# Altium schematic sheet Deneigus_PI_Arduino.SchDoc
size Tabloid; Date: Date; Author: Author 1; Revision: 1; Size: 11x17; Sheet_Name: PI_Arduino
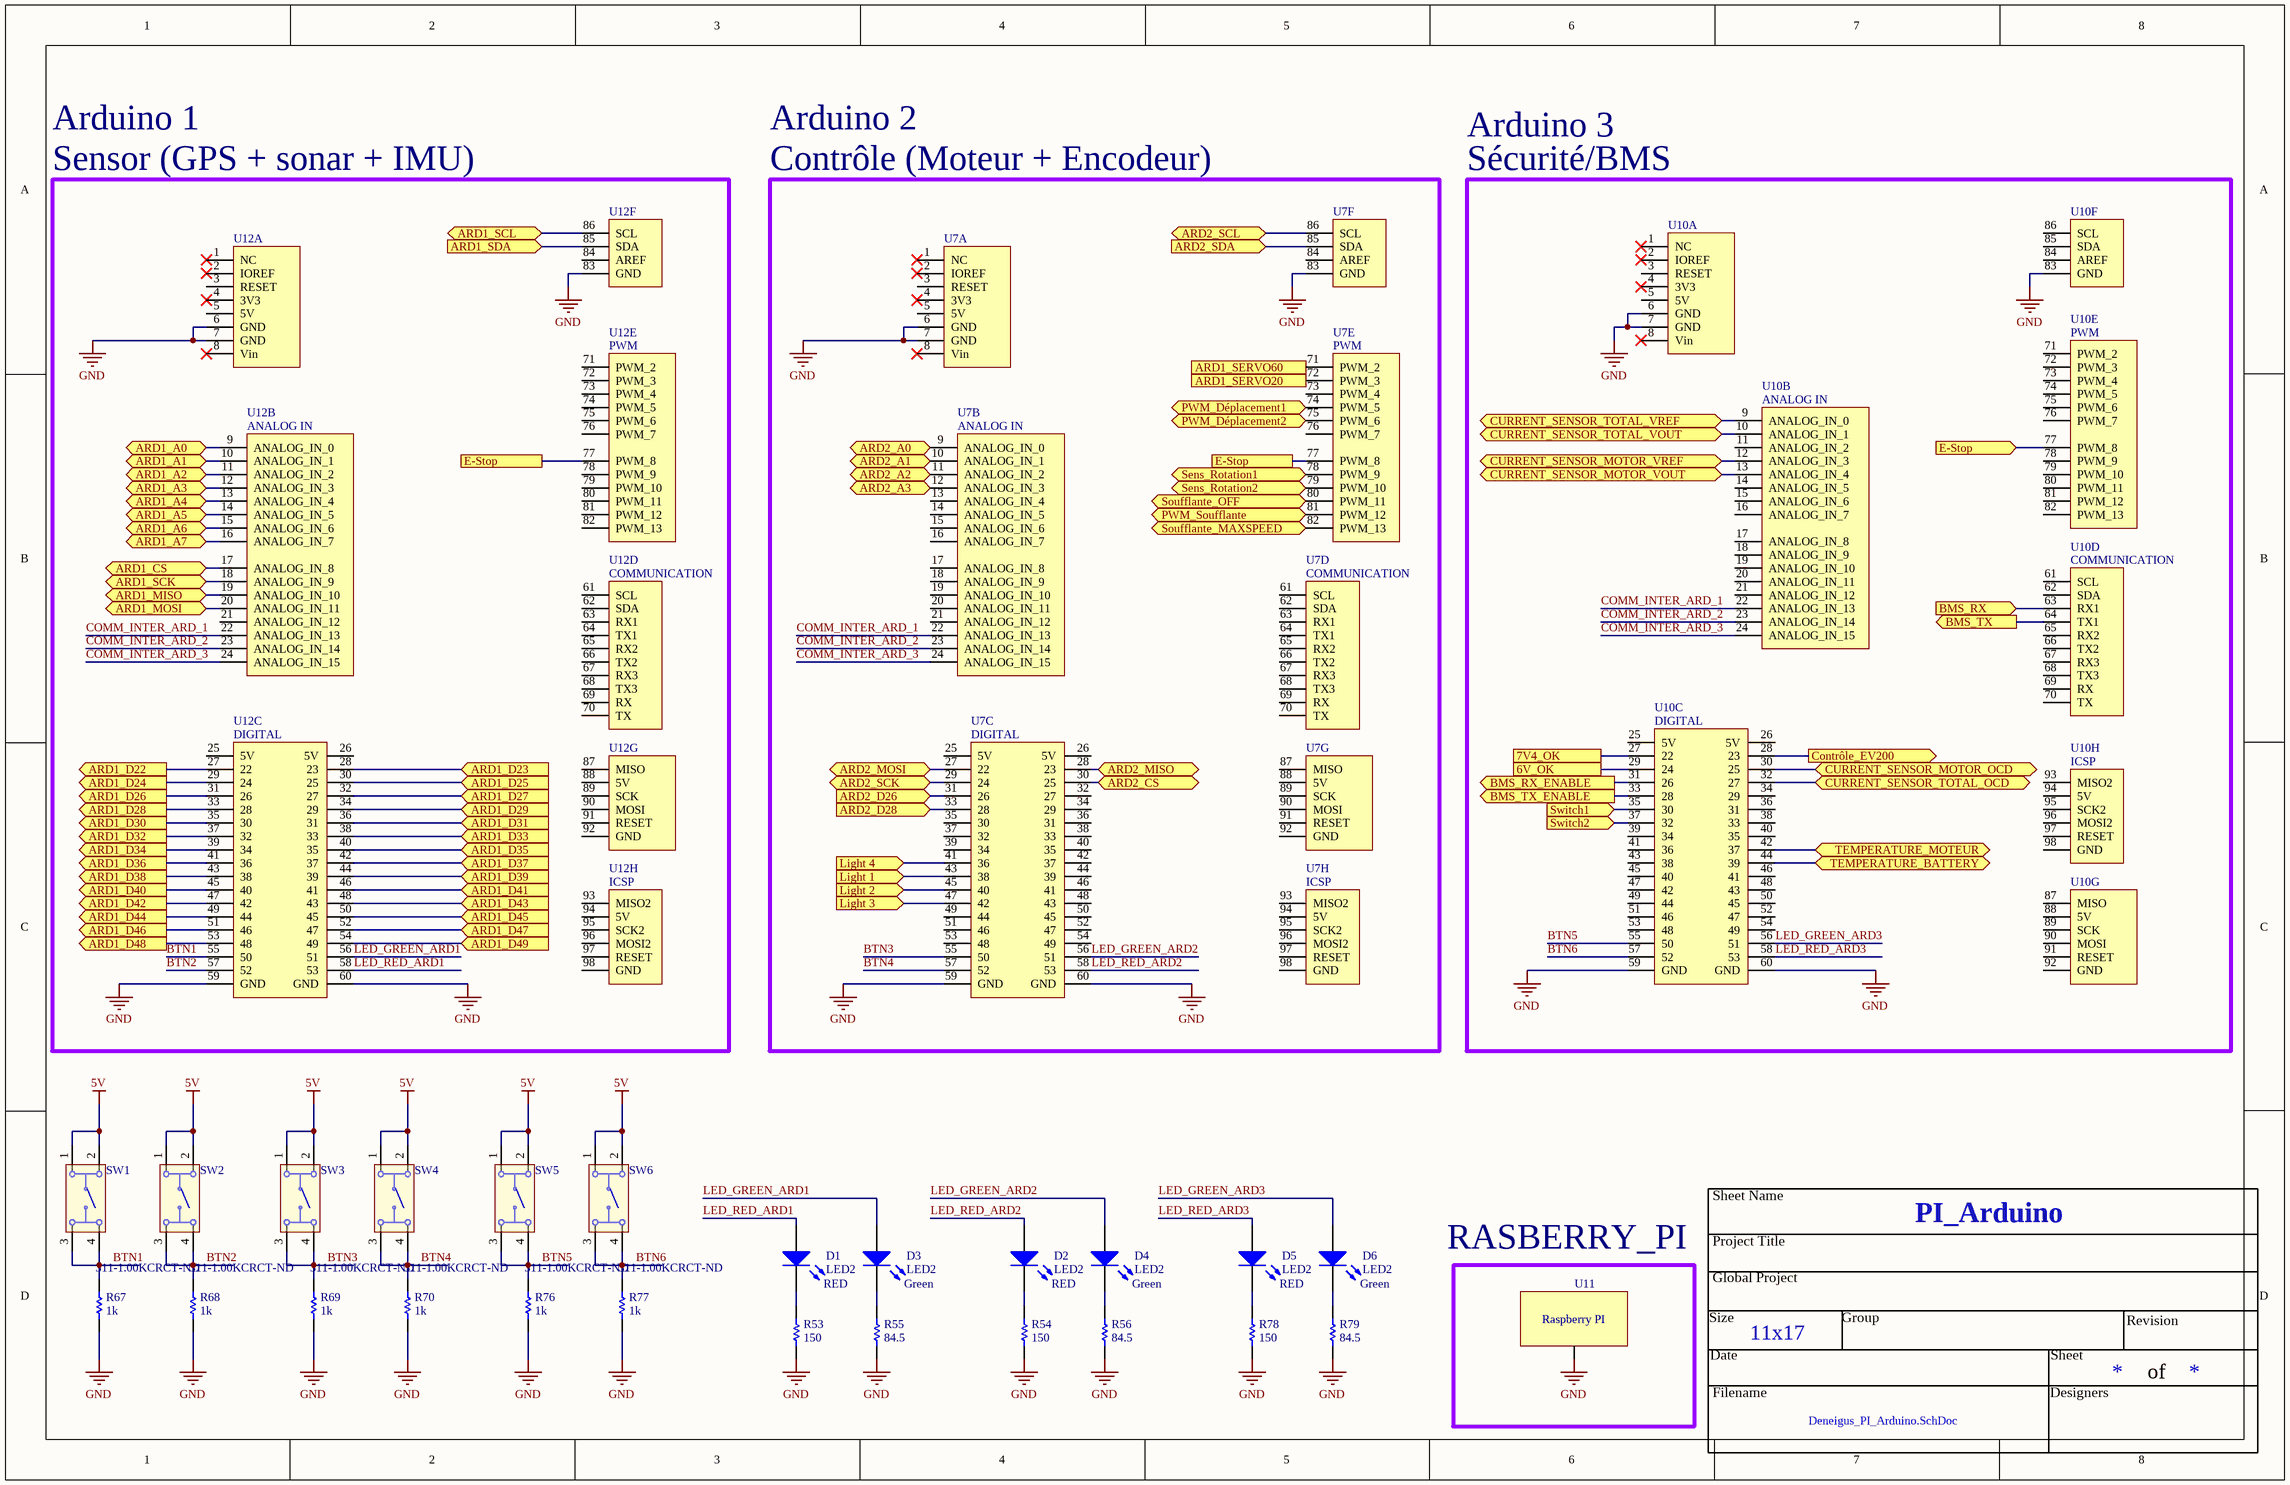
[diagram p0: Deneigus_PI_Arduino.SchDoc]

## Parts
D1  LED2  Color: RED  [DEL]
D2  LED2  Color: RED  [DEL]
D3  LED2  Color: Green  [DEL]
D4  LED2  Color: Green  [DEL]
D5  LED2  Color: RED  [DEL]
D6  LED2  Color: Green  [DEL]
R53  value 150  [RES_0805]  (hidden comment: Res1)
R54  value 150  [RES_0805]  (hidden comment: Res1)
R55  value 84.5  [RES_0805]  (hidden comment: Res1)
R56  value 84.5  [RES_0805]  (hidden comment: Res1)
R67  value 1k  Supplier Part Number 1: 311-1.00KCRCT-ND  [RES_0805]  (hidden comment: Res1)
R68  value 1k  Supplier Part Number 1: 311-1.00KCRCT-ND  [RES_0805]  (hidden comment: Res1)
R69  value 1k  Supplier Part Number 1: 311-1.00KCRCT-ND  [RES_0805]  (hidden comment: Res1)
R70  value 1k  Supplier Part Number 1: 311-1.00KCRCT-ND  [RES_0805]  (hidden comment: Res1)
R76  value 1k  Supplier Part Number 1: 311-1.00KCRCT-ND  [RES_0805]  (hidden comment: Res1)
R77  value 1k  Supplier Part Number 1: 311-1.00KCRCT-ND  [RES_0805]  (hidden comment: Res1)
R78  value 150  [RES_0805]  (hidden comment: Res1)
R79  value 84.5  [RES_0805]  (hidden comment: Res1)
SW1  430181038816  [430181038816]  (value not drawn)
SW2  430181038816  [430181038816]  (value not drawn)
SW3  430181038816  [430181038816]  (value not drawn)
SW4  430181038816  [430181038816]  (value not drawn)
SW5  430181038816  [430181038816]  (value not drawn)
SW6  430181038816  [430181038816]  (value not drawn)
U7  Arduino_Mega  [Arduino_Mega]  (value not drawn)  (parts A,B,C,D,E,F,G,H of 8)
U10  Arduino_Mega  [Arduino_Mega]  (value not drawn)  (parts A,B,C,D,E,F,G,H of 8)
U11  Raspberry PI 4  [Raspberry Pi 4]  (value not drawn)
U12  Arduino_Mega  [Arduino_Mega]  (value not drawn)  (parts A,B,C,D,E,F,G,H of 8)

## Blocks framed on the sheet
Sensor (GPS + sonar + IMU): U12
Contrôle (Moteur + Encodeur): U7
Sécurité/BMS: U10

## Ports
6V_OK, 7V4_OK, ARD1_A0 (bidir), ARD1_A1 (bidir), ARD1_A2 (bidir), ARD1_A3 (bidir), ARD1_A4 (bidir), ARD1_A5 (bidir), ARD1_A6 (bidir), ARD1_A7 (bidir), ARD1_CS (bidir), ARD1_D22 (out), ARD1_D23 (in), ARD1_D24 (out), ARD1_D25 (in), ARD1_D26 (out), ARD1_D27 (in), ARD1_D28 (out), ARD1_D29 (in), ARD1_D30 (out), ARD1_D31 (in), ARD1_D32 (out), ARD1_D33 (in), ARD1_D34 (out), ARD1_D35 (in), ARD1_D36 (out), ARD1_D37 (in), ARD1_D38 (out), ARD1_D39 (in), ARD1_D40 (out), ARD1_D41 (in), ARD1_D42 (out), ARD1_D43 (in), ARD1_D44 (out), ARD1_D45 (in), ARD1_D46 (out), ARD1_D47 (in), ARD1_D48 (out), ARD1_D49 (in), ARD1_MISO (bidir), ARD1_MOSI (bidir), ARD1_SCK (bidir), ARD1_SCL (bidir), ARD1_SDA (in), ARD1_SERVO20 (out), ARD1_SERVO60 (out), ARD2_A0 (bidir), ARD2_A1 (bidir), ARD2_A2 (bidir), ARD2_A3 (bidir), ARD2_CS (bidir), ARD2_D26 (in), ARD2_D28 (in), ARD2_MISO (bidir), ARD2_MOSI (bidir), ARD2_SCK (bidir), ARD2_SCL (bidir), ARD2_SDA (in), BMS_RX (in), BMS_RX_ENABLE (out), BMS_TX (out), BMS_TX_ENABLE (out), Contrôle_EV200 (out), CURRENT_SENSOR_MOTOR_OCD (bidir), CURRENT_SENSOR_MOTOR_VOUT (bidir), CURRENT_SENSOR_MOTOR_VREF (bidir), CURRENT_SENSOR_TOTAL_OCD (bidir), CURRENT_SENSOR_TOTAL_VOUT (bidir), CURRENT_SENSOR_TOTAL_VREF (bidir), E-Stop, E-Stop (in), Light 1 (in), Light 2 (in), Light 3 (in), Light 4 (in), PWM_Déplacement1 (bidir), PWM_Déplacement2 (bidir), PWM_Soufflante (bidir), Sens_Rotation1 (bidir), Sens_Rotation2 (bidir), Soufflante_MAXSPEED (bidir), Soufflante_OFF (bidir), Switch1 (in), Switch2 (in), TEMPERATURE_BATTERY (bidir), TEMPERATURE_MOTEUR (bidir)

## Nets
5V: SW1.1 SW1.2 SW2.1 SW2.2 SW3.1 SW3.2 SW4.1 SW4.2 SW5.1 SW5.2 SW6.1 SW6.2
GND: R53.2 R54.2 R55.2 R56.2 R67.2 R68.2 R69.2 R70.2 R76.2 R77.2 R78.2 R79.2 U7.6(GND) U7.7(GND) U7.59(GND) U7.60(GND) U7.83(GND) U10.6(GND) U10.7(GND) U10.59(GND) U10.60(GND) U10.83(GND) U11.0 U12.6(GND) U12.7(GND) U12.59(GND) U12.60(GND) U12.83(GND)
6V_OK: U10.29(24) ; port 6V_OK
7V4_OK: U10.27(22) ; port 7V4_OK
ARD1_A0: U12.9(ANALOG_IN_0) ; port ARD1_A0
ARD1_A1: U12.10(ANALOG_IN_1) ; port ARD1_A1
ARD1_A2: U12.11(ANALOG_IN_2) ; port ARD1_A2
ARD1_A3: U12.12(ANALOG_IN_3) ; port ARD1_A3
ARD1_A4: U12.13(ANALOG_IN_4) ; port ARD1_A4
ARD1_A5: U12.14(ANALOG_IN_5) ; port ARD1_A5
ARD1_A6: U12.15(ANALOG_IN_6) ; port ARD1_A6
ARD1_A7: U12.16(ANALOG_IN_7) ; port ARD1_A7
ARD1_CS: U12.17(ANALOG_IN_8) ; port ARD1_CS
ARD1_D22: U12.27(22) ; port ARD1_D22
ARD1_D23: U12.28(23) ; port ARD1_D23
ARD1_D24: U12.29(24) ; port ARD1_D24
ARD1_D25: U12.30(25) ; port ARD1_D25
ARD1_D26: U12.31(26) ; port ARD1_D26
ARD1_D27: U12.32(27) ; port ARD1_D27
ARD1_D28: U12.33(28) ; port ARD1_D28
ARD1_D29: U12.34(29) ; port ARD1_D29
ARD1_D30: U12.35(30) ; port ARD1_D30
ARD1_D31: U12.36(31) ; port ARD1_D31
ARD1_D32: U12.37(32) ; port ARD1_D32
ARD1_D33: U12.38(33) ; port ARD1_D33
ARD1_D34: U12.39(34) ; port ARD1_D34
ARD1_D35: U12.40(35) ; port ARD1_D35
ARD1_D36: U12.41(36) ; port ARD1_D36
ARD1_D37: U12.42(37) ; port ARD1_D37
ARD1_D38: U12.43(38) ; port ARD1_D38
ARD1_D39: U12.44(39) ; port ARD1_D39
ARD1_D40: U12.45(40) ; port ARD1_D40
ARD1_D41: U12.46(41) ; port ARD1_D41
ARD1_D42: U12.47(42) ; port ARD1_D42
ARD1_D43: U12.48(43) ; port ARD1_D43
ARD1_D44: U12.49(44) ; port ARD1_D44
ARD1_D45: U12.50(45) ; port ARD1_D45
ARD1_D46: U12.51(46) ; port ARD1_D46
ARD1_D47: U12.52(47) ; port ARD1_D47
ARD1_D48: U12.53(48) ; port ARD1_D48
ARD1_D49: U12.54(49) ; port ARD1_D49
ARD1_MISO: U12.19(ANALOG_IN_10) ; port ARD1_MISO
ARD1_MOSI: U12.20(ANALOG_IN_11) ; port ARD1_MOSI
ARD1_SCK: U12.18(ANALOG_IN_9) ; port ARD1_SCK
ARD1_SCL: U12.86(SCL) ; port ARD1_SCL
ARD1_SDA: U12.85(SDA) ; port ARD1_SDA
ARD1_SERVO20: U7.72(PWM_3) ; port ARD1_SERVO20
ARD1_SERVO60: U7.71(PWM_2) ; port ARD1_SERVO60
ARD2_A0: U7.9(ANALOG_IN_0) ; port ARD2_A0
ARD2_A1: U7.10(ANALOG_IN_1) ; port ARD2_A1
ARD2_A2: U7.11(ANALOG_IN_2) ; port ARD2_A2
ARD2_A3: U7.12(ANALOG_IN_3) ; port ARD2_A3
ARD2_CS: U7.30(25) ; port ARD2_CS
ARD2_D26: U7.31(26) ; port ARD2_D26
ARD2_D28: U7.33(28) ; port ARD2_D28
ARD2_MISO: U7.28(23) ; port ARD2_MISO
ARD2_MOSI: U7.27(22) ; port ARD2_MOSI
ARD2_SCK: U7.29(24) ; port ARD2_SCK
ARD2_SCL: U7.86(SCL) ; port ARD2_SCL
ARD2_SDA: U7.85(SDA) ; port ARD2_SDA
BMS_RX: U10.63(RX1) ; port BMS_RX
BMS_RX_ENABLE: U10.31(26) ; port BMS_RX_ENABLE
BMS_TX: U10.64(TX1) ; port BMS_TX
BMS_TX_ENABLE: U10.33(28) ; port BMS_TX_ENABLE
BTN1: R67.1 SW1.3 SW1.4 U12.55(50)
BTN2: R68.1 SW2.3 SW2.4 U12.57(52)
BTN3: R69.1 SW3.3 SW3.4 U7.55(50)
BTN4: R70.1 SW4.3 SW4.4 U7.57(52)
BTN5: R76.1 SW5.3 SW5.4 U10.55(50)
BTN6: R77.1 SW6.3 SW6.4 U10.57(52)
COMM_INTER_ARD_1: U7.22(ANALOG_IN_13) U10.22(ANALOG_IN_13) U12.22(ANALOG_IN_13)
COMM_INTER_ARD_2: U7.23(ANALOG_IN_14) U10.23(ANALOG_IN_14) U12.23(ANALOG_IN_14)
COMM_INTER_ARD_3: U7.24(ANALOG_IN_15) U10.24(ANALOG_IN_15) U12.24(ANALOG_IN_15)
Contrôle_EV200: U10.28(23) ; port Contrôle_EV200
CURRENT_SENSOR_MOTOR_OCD: U10.30(25) ; port CURRENT_SENSOR_MOTOR_OCD
CURRENT_SENSOR_MOTOR_VOUT: U10.13(ANALOG_IN_4) ; port CURRENT_SENSOR_MOTOR_VOUT
CURRENT_SENSOR_MOTOR_VREF: U10.12(ANALOG_IN_3) ; port CURRENT_SENSOR_MOTOR_VREF
CURRENT_SENSOR_TOTAL_OCD: U10.32(27) ; port CURRENT_SENSOR_TOTAL_OCD
CURRENT_SENSOR_TOTAL_VOUT: U10.10(ANALOG_IN_1) ; port CURRENT_SENSOR_TOTAL_VOUT
CURRENT_SENSOR_TOTAL_VREF: U10.9(ANALOG_IN_0) ; port CURRENT_SENSOR_TOTAL_VREF
E-Stop: U7.77(PWM_8) U10.77(PWM_8) U12.77(PWM_8) ; port E-Stop
LED_GREEN_ARD1: D3.1(A) U12.56(51)
LED_GREEN_ARD2: D4.1(A) U7.56(51)
LED_GREEN_ARD3: D6.1(A) U10.56(51)
LED_RED_ARD1: D1.1(A) U12.58(53)
LED_RED_ARD2: D2.1(A) U7.58(53)
LED_RED_ARD3: D5.1(A) U10.58(53)
Light 1: U7.43(38) ; port Light 1
Light 2: U7.45(40) ; port Light 2
Light 3: U7.47(42) ; port Light 3
Light 4: U7.41(36) ; port Light 4
PWM_Déplacement1: U7.74(PWM_5) ; port PWM_Déplacement1
PWM_Déplacement2: U7.75(PWM_6) ; port PWM_Déplacement2
PWM_Soufflante: U7.81(PWM_12) ; port PWM_Soufflante
Sens_Rotation1: U7.78(PWM_9) ; port Sens_Rotation1
Sens_Rotation2: U7.79(PWM_10) ; port Sens_Rotation2
Soufflante_MAXSPEED: U7.82(PWM_13) ; port Soufflante_MAXSPEED
Soufflante_OFF: U7.80(PWM_11) ; port Soufflante_OFF
Switch1: U10.35(30) ; port Switch1
Switch2: U10.37(32) ; port Switch2
TEMPERATURE_BATTERY: U10.44(39) ; port TEMPERATURE_BATTERY
TEMPERATURE_MOTEUR: U10.42(37) ; port TEMPERATURE_MOTEUR
NetD1_2: D1.2(K) R53.1
NetD2_2: D2.2(K) R54.1
NetD3_2: D3.2(K) R55.1
NetD4_2: D4.2(K) R56.1
NetD5_2: D5.2(K) R78.1
NetD6_2: D6.2(K) R79.1

Not connected (* = marked no-connect by the designer): U7 1(NC)* 2(IOREF)* 3(RESET) 4(3V3)* 5(5V) 8(Vin)* 13(ANALOG_IN_4) 14(ANALOG_IN_5) 15(ANALOG_IN_6) 16(ANALOG_IN_7) 17(ANALOG_IN_8) 18(ANALOG_IN_9) 19(ANALOG_IN_10) 20(ANALOG_IN_11) 21(ANALOG_IN_12) 25(5V) 26(5V) 32(27) 34(29) 35(30) 36(31) 37(32) 38(33) 39(34) 40(35) 42(37) 44(39) 46(41) 48(43) 49(44) 50(45) 51(46) 52(47) 53(48) 54(49) 61(SCL) 62(SDA) 63(RX1) 64(TX1) 65(RX2) 66(TX2) 67(RX3) 68(TX3) 69(RX) 70(TX) 73(PWM_4) 76(PWM_7) 84(AREF) 87(MISO) 88(5V) 89(SCK) 90(MOSI) 91(RESET) 92(GND) 93(MISO2) 94(5V) 95(SCK2) 96(MOSI2) 97(RESET) 98(GND); U10 1(NC)* 2(IOREF)* 3(RESET) 4(3V3)* 5(5V) 8(Vin)* 11(ANALOG_IN_2) 14(ANALOG_IN_5) 15(ANALOG_IN_6) 16(ANALOG_IN_7) 17(ANALOG_IN_8) 18(ANALOG_IN_9) 19(ANALOG_IN_10) 20(ANALOG_IN_11) 21(ANALOG_IN_12) 25(5V) 26(5V) 34(29) 36(31) 38(33) 39(34) 40(35) 41(36) 43(38) 45(40) 46(41) 47(42) 48(43) 49(44) 50(45) 51(46) 52(47) 53(48) 54(49) 61(SCL) 62(SDA) 65(RX2) 66(TX2) 67(RX3) 68(TX3) 69(RX) 70(TX) 71(PWM_2) 72(PWM_3) 73(PWM_4) 74(PWM_5) 75(PWM_6) 76(PWM_7) 78(PWM_9) 79(PWM_10) 80(PWM_11) 81(PWM_12) 82(PWM_13) 84(AREF) 85(SDA) 86(SCL) 87(MISO) 88(5V) 89(SCK) 90(MOSI) 91(RESET) 92(GND) 93(MISO2) 94(5V) 95(SCK2) 96(MOSI2) 97(RESET) 98(GND); U12 1(NC)* 2(IOREF)* 3(RESET) 4(3V3)* 5(5V) 8(Vin)* 21(ANALOG_IN_12) 25(5V) 26(5V) 61(SCL) 62(SDA) 63(RX1) 64(TX1) 65(RX2) 66(TX2) 67(RX3) 68(TX3) 69(RX) 70(TX) 71(PWM_2) 72(PWM_3) 73(PWM_4) 74(PWM_5) 75(PWM_6) 76(PWM_7) 78(PWM_9) 79(PWM_10) 80(PWM_11) 81(PWM_12) 82(PWM_13) 84(AREF) 87(MISO) 88(5V) 89(SCK) 90(MOSI) 91(RESET) 92(GND) 93(MISO2) 94(5V) 95(SCK2) 96(MOSI2) 97(RESET) 98(GND)

## Notes on the sheet
- Arduino 1
- Arduino 2
- Arduino 3
- RASBERRY_PI
- Sheet Name
- Project Title
- Global Project
- Revision
- Size
- Date
- Group
- Sheet
- of
- Filename
- Designers
- (in symbol Arduino_Mega, part B) ANALOG IN
- (in symbol Arduino_Mega, part C) DIGITAL
- (in symbol Arduino_Mega, part D) COMMUNICATION
- (in symbol Arduino_Mega, part E) PWM
- (in symbol Arduino_Mega, part H) ICSP
- (in symbol Raspberry PI 4) Raspberry PI

## Library data of the parts
D1-D6 = LED2: Typical RED, GREEN, YELLOW, AMBER GaAs LED; Published: 8-Jun-2000; LatestRevisionDate: 17-Jul-2002; LatestRevisionNote: Re-released for DXP Platform.; PackageVersion: Feb-2002; PackageReference: 3.2X1.6X1.1; Publisher: Altium Limited; PackageDescription: SM LED; 2 Flat Leads
  D1: Supplier 1: Digi-Key; Supplier Part Number 1: 754-1796-1-ND
  D2 D5: Supplier 1: Digikey; Supplier Part Number 1: 754-1796-1-ND
  D3 D4 D6: Supplier 1: Digi-Key; Supplier Part Number 1: 754-1440-1-ND
R53-R56 R67-R70 R76-R79 = Res1: Resistor; Published: 8-Jun-2000; LatestRevisionDate: 17-Jul-2002; LatestRevisionNote: Re-released for DXP Platform.; PackageReference: AXIAL-0.3; Publisher: Altium Limited; PackageDescription: Axial Device, Thru-Hole; 2 Leads; 0.3 in Pin Spacing
  R53 R54 R78: Supplier 1: digikey; Supplier Part Number 1: RNCP0805FTD150RCT-ND
  R55 R56 R79: Supplier 1: digikey; Supplier Part Number 1: 2019-RK73H2ATTD84R5FCT-ND
  R67-R70 R76 R77: Supplier 1: Digi-Key
SW1-SW6 = CMP-1454-00001-1: WS-TASV SMD Tact Switch 4.5X4.5 mm; Manufacturer: Wuerth Elektronik; NoPins: 04; PartNumber: 430181038816; ComponentLink1Description: Manufacturer URL; ComponentLink2URL: http://katalog.we-online.de/em/datasheet/430181038816.pdf; ComponentLink1URL: http://www.we-online.com; PackageReference: 430181038816; ComponentLink2Description: Datasheet